# EAGLE design USB-to-UART (EAGLE 8.2.2)
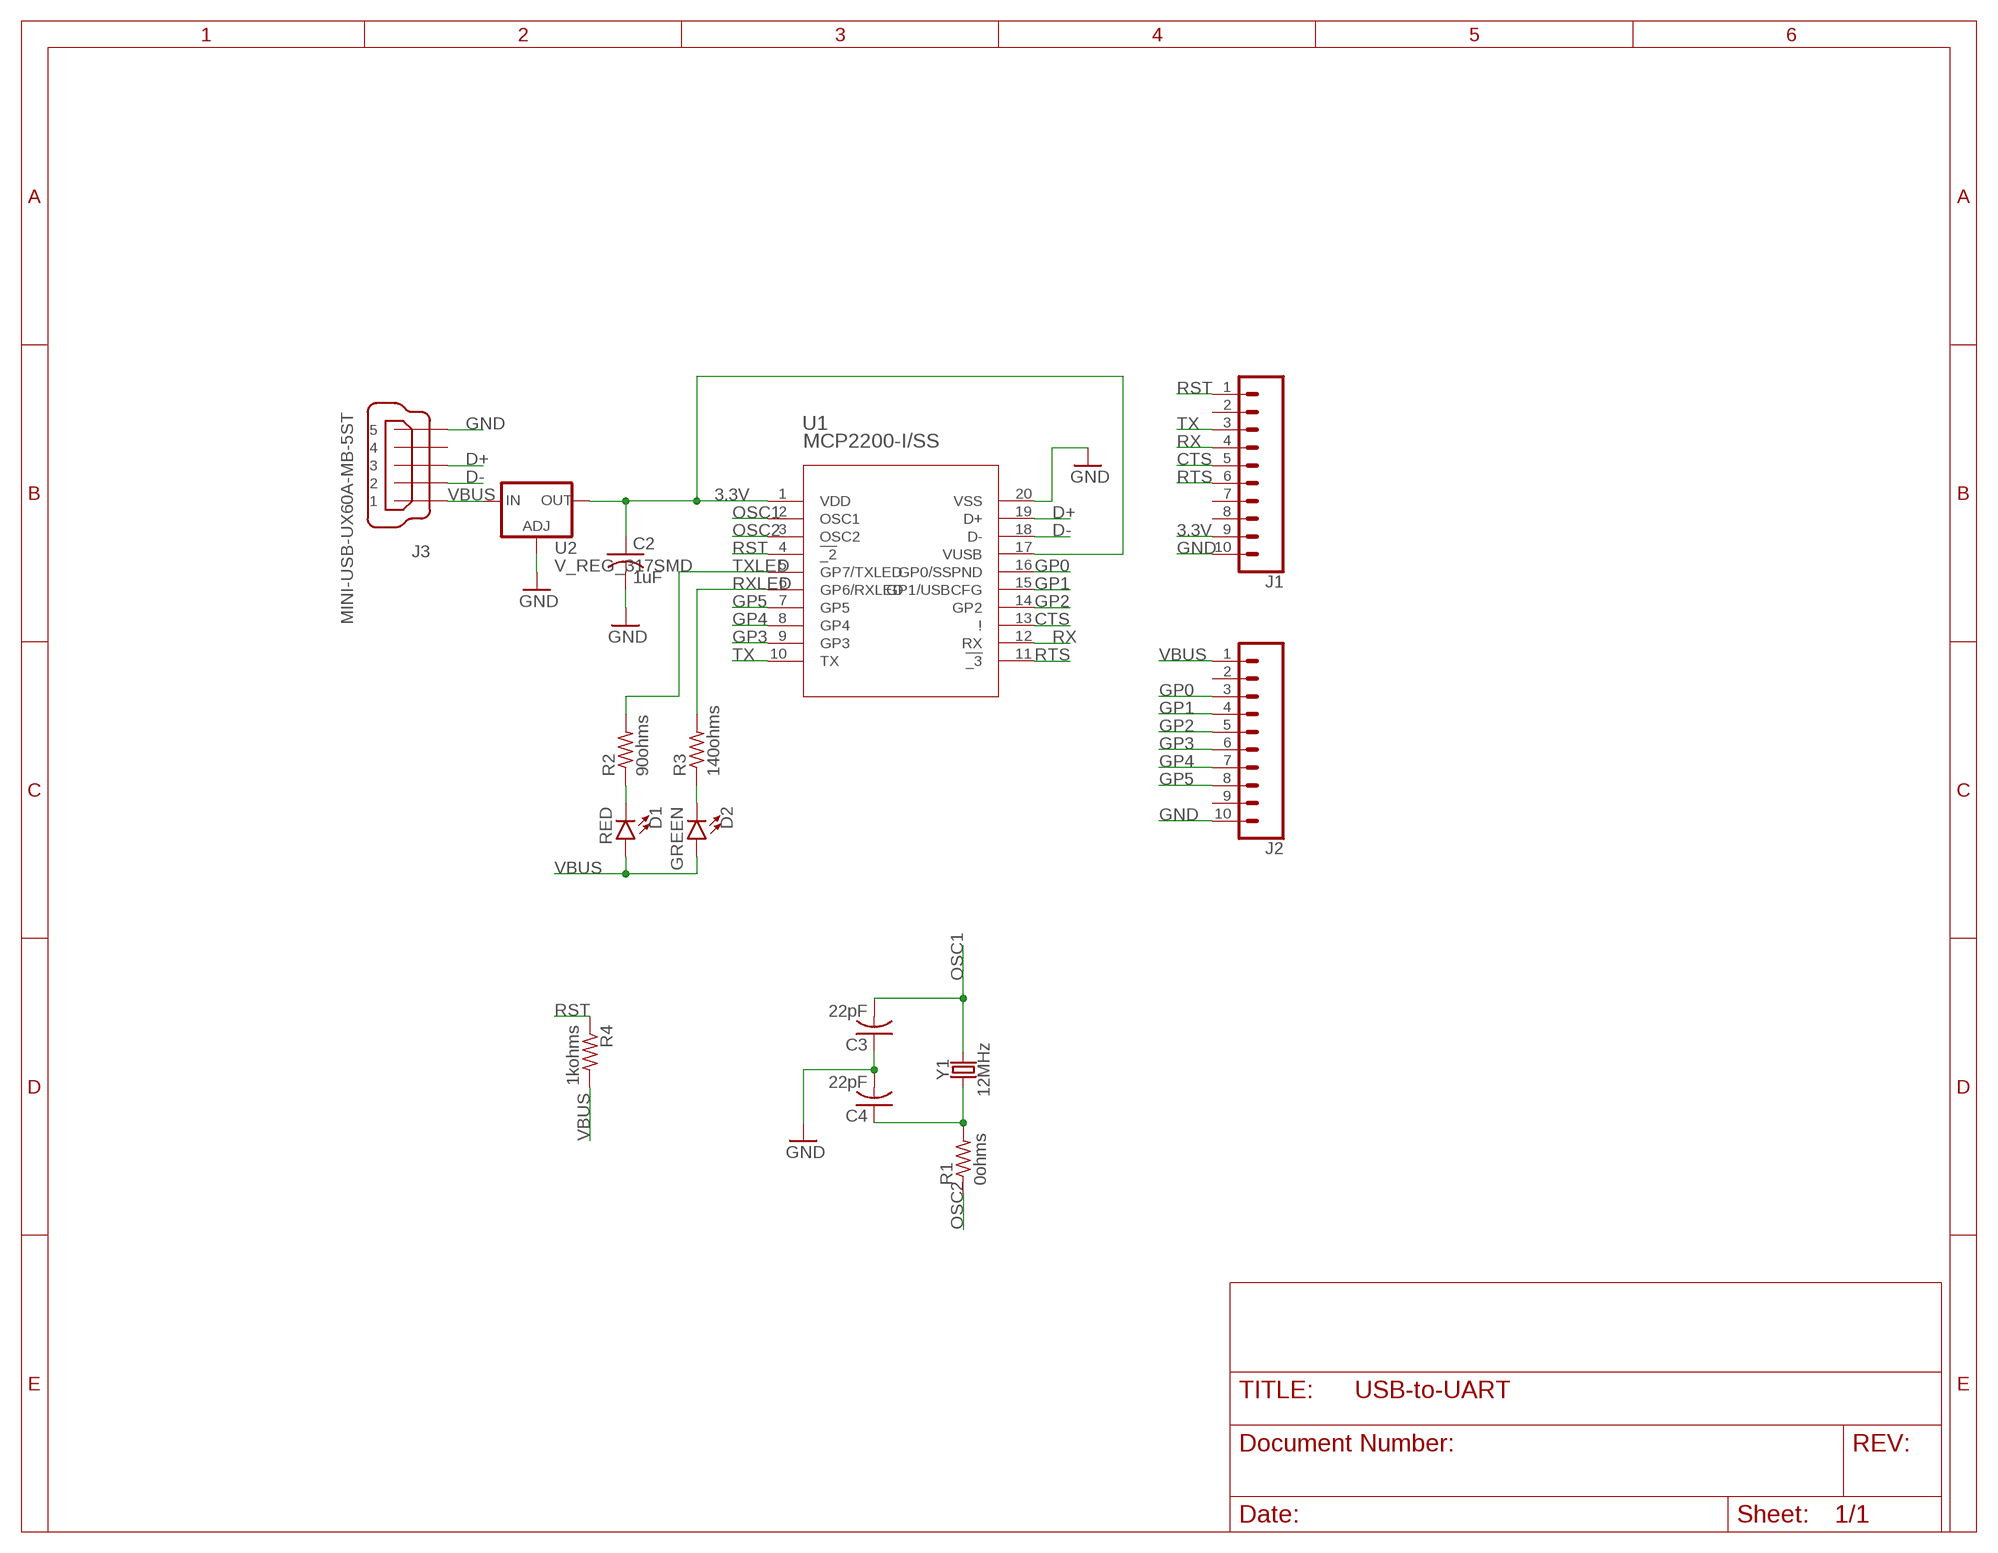
[diagram p0: schematic, sheet 1]

## Parts
C2  1uF  C-USC0603  [C0603]
C3  22pF  C-USC0603  [C0603]
C4  22pF  C-USC0603  [C0603]
D1  RED  LED0603  [LED-0603]
D2  GREEN  LED0603  [LED-0603]
J1  CONN_10"  [1X10]
J2  CONN_10"  [1X10]
J3  MINI-USB-UX60A-MB-5ST  [UX60A-MB-5ST]
R1  0ohms  R-US_R0603  [R0603]
R2  90ohms  R-US_R0603  [R0603]
R3  140ohms  R-US_R0603  [R0603]
R4  1kohms  R-US_R0603  [R0603]
U1  MCP2200-I/SS  [SSOP20_MC]
U2  V_REG_317SMD  [SOT223]
Y1  12MHz  CRYSTAL-12MHZ"  [CRYSTAL-SMD-5X3.2-4PAD]

## Nets
3.3V: C2.1 J1.9 U1.1(VDD) U1.17(VUSB) U2.2(OUT)
CTS: J1.5 U1.13(!)
D+: J3.3 U1.19(D+)
D-: J3.2 U1.18(D-)
GND: C2.2 C3.1 C4.2 J1.10 J2.10 J3.5 U1.20(VSS) U2.1(ADJ)
GP0: J2.3 U1.16(GP0/SSPND)
GP1: J2.4 U1.15(GP1/USBCFG)
GP2: J2.5 U1.14(GP2)
GP3: J2.6 U1.9(GP3)
GP4: J2.7 U1.8(GP4)
GP5: J2.8 U1.7(GP5)
N$1: D1.C R2.1
N$2: C4.1 R1.2 Y1.1
N$3: D2.C R3.1
OSC1: C3.2 U1.2(OSC1) Y1.3
OSC2: R1.1 U1.3(OSC2)
RST: J1.1 R4.1 U1.4(!_2)
RTS: J1.6 U1.11(!_3)
RX: J1.4 U1.12(RX)
RXLED: R3.2 U1.6(GP6/RXLED)
TX: J1.3 U1.10(TX)
TXLED: R2.2 U1.5(GP7/TXLED)
VBUS: D1.A D2.A J2.1 J3.1 R4.2 U2.3(IN)
Unconnected: J1.2 J1.7 J1.8 J2.2 J2.9 J3.4

## Library data of the parts
C2-C4 = rcl:C-US: CAPACITOR, American symbol
D1 D2 = SparkFun-LED:LED: LED (Generic) Standard schematic elements and footprints for 5mm, 3mm, 1206, and 0603 sized LEDs. Generic LEDs with no color specified.
J1 J2 = SparkFun-Connectors:CONN_10: Multi connection point. Often used as Generic Header-pin footprint for 0.1 inch spaced/style header connections On any of the 0.1 inch spaced packages, you can populate with these: Break Away Headers - Straight <https://www.sparkfun.com/products/116> (PRT-00116) Break Away Male Headers - Right Angle <https://www.sparkfun.com/products/553> (PRT-00553) Female Headers <https://www.sparkfun.com/products/115> (PRT-00115) Break Away Headers - Machine Pin <https://www.sparkfun.com/products/117> (PRT-00117) Break Away Female Headers - Swiss Machine Pin <https://www.sparkfun.com/products/743> (PRT-00743) Arduino Stackable Header - 10 Pin <https://www.sparkfun.com/products/11376> (PRT-11376) For SCREWTERMINALS and SPRING TERMINALS visit here: Screw Terimnals on SparkFun.com <https://www.sparkfun.com/search/results?term=Screw+Terminals> (5mm/3.5mm/2.54mm spacing) This device is also useful as a general connection point to wire up your design to another part of your project. Our various solder wires solder well into these plated through hole pads. Hook-Up Wire - Assortment (Stranded, 22 AWG) <https://www.sparkfun.com/products/11375> (PRT-11375) Hook-Up Wire - Assortment (Solid Core, 22 AWG) <https://www.sparkfun.com/products/11367> (PRT-11367) View the entire wire category on our website here <https://www.sparkfun.com/categories/141> Special notes: Molex polarized connector foot print use with SKU : PRT-08231 with associated crimp pins and housings. 1MM SMD Version SKU: PRT-10208 NOTES ON THE VARIANTS LOCK and LOCK_LONGPADS... This footprint was designed to help hold the alignment of a through-hole component (i.e. 6-pin header) while soldering it into place. You may notice that each hole has been shifted either up or down by 0.005 of an inch from it's more standard position (which is a perfectly straight line). This slight alteration caused the pins (the squares in the middle) to touch the edges of the holes. Because they are alternating, it causes a "brace" to hold the component in place. 0.005 has proven to be the perfect amount of "off-center" position when using our standard breakaway headers. Although looks a little odd when you look at the bare footprint, once you have a header in there, the alteration is very hard to notice. Also,if you push a header all the way into place, it is covered up entirely on the bottom side.; PROD_ID: CONN-11563
J3 = con-hirose:MINI-USB-: MINI USB Connector Source: http://www.hirose.co.jp/cataloge_hp/e24000019.pdf; OC_FARNELL: unknown; OC_NEWARK: unknown
R1-R4 = resistor:R-US_: RESISTOR, American symbol
U1 = MyLibrary - Components:MCP2200-I/SS; MANUFACTURER_PART_NUMBER: MCP2200ISS; VENDOR: Microchip
U2 = SparkFun-IC-Power:V_REG_317: Voltage Regulator Standard LM317 adjustable voltage regulator. AOI (Adjust Output Input). Google 'LM317 Calculator' for easy to use app to get the two resistor values needed. 240/720 for 5V output. 240/390 for 3.3V output. Spark Fun Electronics SKU : COM-00527
Y1 = SparkFun-Clocks:CRYSTAL-12MHZ: 12.0MHz Crystal Frequency: 12.0MHz Frequency Tolerance: ±20ppm Load Capacitance: 18pF SparkFun Products: SparkFun Logomatic <https://www.sparkfun.com/products/12772> Pocket AVR Programmer <https://www.sparkfun.com/products/9825>; PROD_ID: XTAL-08297

## Board
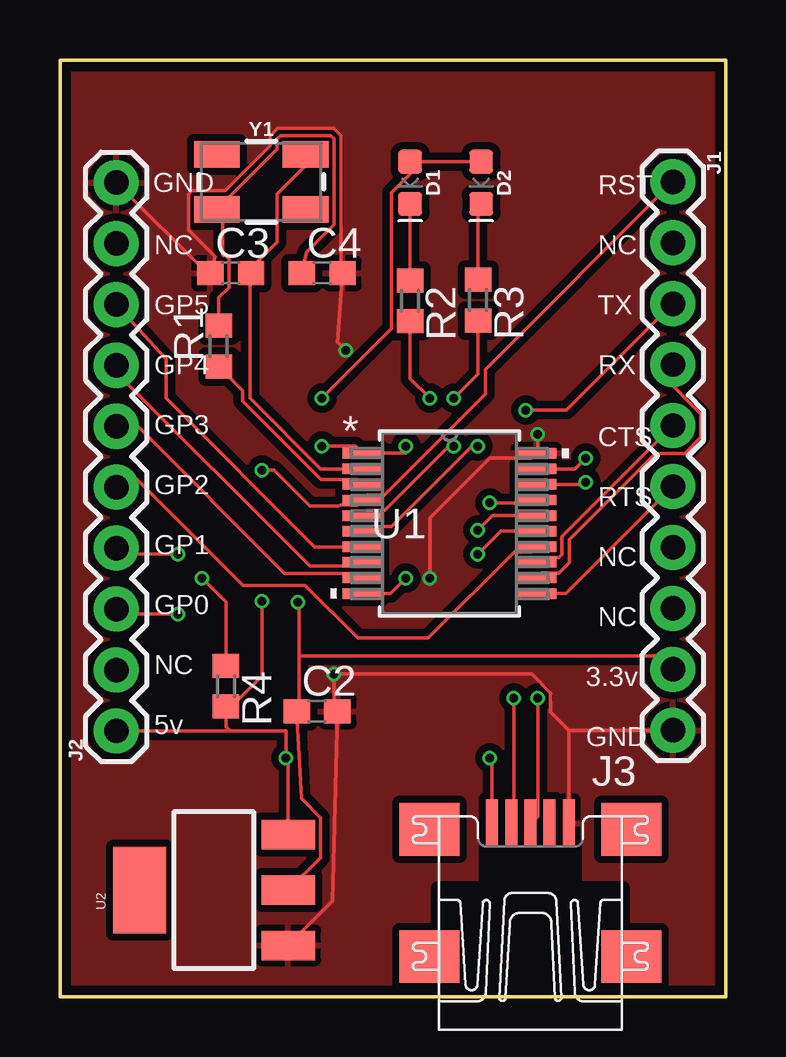
[diagram p1: board, top side]
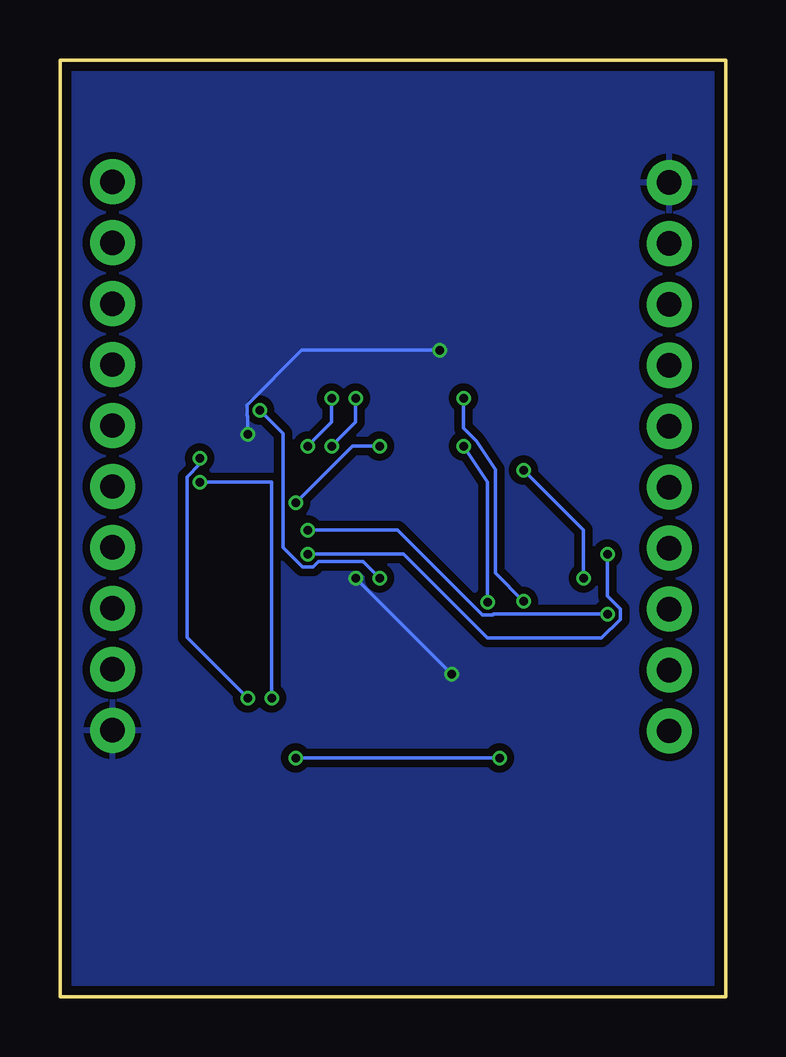
[diagram p2: board, bottom side, seen from below]

Size 27.75 x 39.06 mm. Coordinates in mm from the lower left corner, seen from the top.
Outline: 0,0 0,39.06 27.75,39.06 27.75,0 0,0
Copper layers (1*16): Top 0.035559375mm / dielectric 1.6mm / Bottom 0.035559375mm
Design rules "oshpark-2layer": minimum track width 6mil, minimum drill 10mil, track to track 6mil, track to pad 6mil, pad to pad 6mil, via to via 6mil, smd to smd 6mil, copper to edge 15mil, drill to drill 6mil, minimum pad ring 5mil, minimum via ring 5mil, stop-mask expansion 2.5mil, vias tented up to drill 0mil, thermal gap 10mil

### Footprints (pad centres in the part's own frame; a part is rotated, then mirrored left to right if it is on the bottom)
C0603 = smd 1.1 x 1: 1 -0.85,0; 2 0.85,0
LED-0603 = smd 1 x 1: A -0.877,0; C 0.877,0
1X10 = drill 1.016 pad 1.88: 1 0,0; 2 2.54,0; 3 5.08,0; 4 7.62,0; 5 10.16,0; 6 12.7,0; 7 15.24,0; 8 17.78,0; 9 20.32,0; 10 22.86,0
UX60A-MB-5ST = smd 2 x 0.5: 1 2.25,1.6; 2 2.25,0.8; 3 2.25,0; 4 2.25,-0.8; 5 2.25,-1.6 | smd 2.2 x 2.5: M1 -3.3,-4.2; M2 -3.3,4.2; M3 2,4.2; M4 2,-4.2
R0603 = smd 1 x 1.1: 1 -0.85,0; 2 0.85,0
SSOP20_MC = smd 1.651 x 0.432: 1 -3.632,2.925; 2 -3.632,2.275; 3 -3.632,1.625; 4 -3.632,0.975; 5 -3.632,0.325; 6 -3.632,-0.325; 7 -3.632,-0.975; 8 -3.632,-1.625; 9 -3.632,-2.275; 10 -3.632,-2.925; 11 3.632,-2.925; 12 3.632,-2.275; 13 3.632,-1.625; 14 3.632,-0.975; 15 3.632,-0.325; 16 3.632,0.325; 17 3.632,0.975; 18 3.632,1.625; 19 3.632,2.275; 20 3.632,2.925
SOT223 = smd 1.219 x 2.235: 1 -2.311,-3.099; 2 0,-3.099; 3 2.311,-3.099 | smd 3.6 x 2.2: 4 0,3.099
CRYSTAL-SMD-5X3.2-4PAD = smd 1.9 x 1.1: 1 -1.85,-1.15; 2 1.85,-1.15; 3 1.85,1.15; 4 -1.85,1.15

### Placement (x,y rotation side)
C2  10.72,11.91 0 top
C3  7.12,30.17 0 top
C4  10.93,30.17 0 top
D1  14.6,33.94 270 top
D2  17.56,33.94 270 top
J1  25.56,33.98 270 top
J2  2.35,11.09 90 top
J3  19.61,4.98 90 top
R1  6.62,27.13 90 top
R2  14.6,29.02 270 top
R3  17.43,29.05 270 top
R4  6.92,12.96 270 top
U1  16.24,19.74 0 top
U2  6.42,4.46 90 top
Y1  8.39,33.98 0 top

### Tracks (layer width: path | path; a pad name or v marks a point on that pad's centre or on a via)
3.3V  (via drill 0.35)
  Top 0.152: 9.97,14.21 9.97,16.41 v9.92,16.46 | U1.1 12.42,22.85 | v10.92,22.96 12.31,22.96 U1.1 | J1.9 25.56,14.21 9.97,14.21 | U1.17 19.87,20.6 v17.92,20.6 | v14.42,22.96 14.42,22.66 U1.1 | U2.2 10.87,5.81 10.87,7.48 10.07,8.27 C2.1 9.97,12.01 9.97,14.21
  Bottom 0.152: v9.92,16.46 9.92,21.46 v10.92,22.96 | v17.92,20.6 15.56,22.96 v14.42,22.96
CTS
  Top 0.152: J1.5 20.93,19.19 20.93,19.1 20.91,19.09 20.93,19.08 20.93,18.45 20.79,18.32 20.08,18.32 U1.13
D+  (via drill 0.35)
  Top 0.152: U1.19 21.48,22.02 v21.92,22.46 | v19.92,12.46 19.92,7.54 J3.3
  Bottom 0.152: 21.92,22.3 v21.92,22.46 | 21.92,22.3 21.92,22.21 | 21.92,22.21 21.92,22.3 | 21.92,22.21 22.45,21.68 22.45,14.99 v19.92,12.46
D-  (via drill 0.35)
  Top 0.152: U1.18 21.83,21.37 v21.92,21.46 | v18.92,12.46 18.92,7.34 J3.2
  Bottom 0.152: v21.92,21.46 18.92,21.46 v18.92,12.46
GND  (via drill 0.35)
  Top 0.152: v15.42,17.46 15.42,19.96 17.92,22.46 19.67,22.46 U1.20 19.92,22.71 v19.92,23.46 | 21.21,11.12 J3.5 | J1.10 21.21,11.12 | 9.52,2.41 U2.1 11.37,4 C2.2 11.42,11.96 v11.42,13.46 19.67,13.46 20.45,12.68 20.45,11.88 21.21,11.12 | J2.10 6.13,30.17 C3.1 6.47,30.86 5.36,31.97 5.36,33.48 5.49,33.61 6.89,33.61 8.76,35.48 8.76,35.9 9.07,36.21 11.41,36.21 11.72,35.9 11.72,30.49 11.58,30.35 C4.2 11.58,27.3 v11.92,26.96
  Bottom 0.152: v15.42,17.46 v11.42,13.46 | v19.92,23.46 19.92,24.21 19.95,24.24 19.95,24.68 17.67,26.96 v11.92,26.96
  pour Bottom (isolate 0.305): -0.08,38.96 27.92,39.46 27.92,-0.04 -0.08,-0.04
  pour Top (isolate 0.305): -0.08,38.96 -0.08,-0.04 27.92,-0.04 27.92,38.96
GP0  (via drill 0.35)
  Top 0.152: U1.16 18.02,20.07 v17.42,19.46 | v4.92,15.96 2.36,15.96 J2.3
  Bottom 0.152: v17.42,19.46 13.67,19.46 10.14,15.93 9.7,15.93 9.67,15.96 v4.92,15.96
GP1  (via drill 0.35)
  Top 0.152: U1.15 18.38,19.41 v17.42,18.46 | v4.92,18.46 2.4,18.46 J2.4
  Bottom 0.152: v17.42,18.46 13.42,18.46 9.92,14.96 5.17,14.96 4.39,15.74 4.39,16.18 4.92,16.71 v4.92,18.46
GP2
  Top 0.152: J2.5 3.19,21.6 7.63,17.15 10.22,17.15 12.42,14.96 15.35,14.96 18.95,18.56 19.67,18.56 U1.14
GP3
  Top 0.152: U1.9 12.42,17.66 9.37,17.66 3.24,23.79 J2.6
GP4
  Top 0.152: J2.7 2.35,26.03 10.42,17.96 12.45,17.96 U1.8
GP5
  Top 0.152: U1.7 10.62,18.77 4.42,24.96 4.42,26.6 J2.8
N$1
  Top 0.152: R2.1 D1.C
N$2
  Top 0.152: C4.1 10.28,31.05 11.42,32.19 11.42,35.77 11.28,35.91 9.2,35.91 9.06,35.77 9.06,35.35 Y1.1 6.73,32.63 6.78,32.56 6.78,30.94 6.8,30.9 | 6.8,30.9 6.91,30.9 7.05,30.77 7.05,29.57 6.62,29.15 R1.2 | 6.8,30.9
N$3
  Top 0.152: R3.1 17.43,32.93 D2.C
OSC1
  Top 0.152: Y1.3 10.24,34.65 9.06,33.48 9.06,31.46 7.83,30.23 | 7.83,30.23 C3.2 | U1.2 10.87,22.02 7.92,24.96 7.92,30.14 7.83,30.23
OSC2
  Top 0.152: U1.3 12.4,21.57 10.88,21.57 7.62,24.83 7.62,25.29 R1.1
RST  (via drill 0.35)
  Top 0.152: R4.1 6.92,16.46 v5.92,17.46 | v8.42,21.96 8.92,21.96 10.42,20.46 11.64,20.46 11.69,20.51 12.4,20.51 U1.4 12.81,20.92 13.53,20.92 17.73,25.13 17.73,26.16 J1.1
  Bottom 0.152: v5.92,17.46 5.92,19.46 v8.42,21.96
RTS
  Top 0.152: U1.11 21.09,16.82 J1.6
RX
  Top 0.152: U1.12 20.08,17.67 20.79,17.67 21.23,18.11 21.23,19.06 24.82,22.65 26.04,22.65 26.73,23.34 26.73,24.3 25.12,25.92 J1.4
RXLED  (via drill 0.35)
  Top 0.152: R3.2 17.43,25.97 v16.42,24.96 | U1.6 12.81,19.62 13.83,19.62 17.17,22.96 v17.42,22.96
  Bottom 0.152: v16.42,24.96 16.42,23.96 v17.42,22.96
TX  (via drill 0.35)
  Top 0.152: U1.10 13.78,16.82 v14.42,17.46 | v19.42,24.46 21.12,24.46 J1.3
  Bottom 0.152: v14.42,17.46 15.12,18.16 16.97,18.16 17.2,17.93 17.64,17.93 18.45,18.74 18.45,23.49 v19.42,24.46
TXLED  (via drill 0.35)
  Top 0.152: R2.2 14.6,25.78 v15.42,24.96 | U1.5 12.81,20.27 13.53,20.27 16.22,22.96 v16.42,22.96
  Bottom 0.152: v15.42,24.96 15.42,23.96 v16.42,22.96
VBUS  (via drill 0.35)
  Top 0.152: J3.1 18.01,9.96 v17.92,9.96 | 9.42,10.05 9.42,11.09 7.1,11.09 | 9.42,10.05 v9.42,9.96 | 7.1,11.09 J2.1 | U2.3 9.52,10.05 9.42,10.05 | 6.92,11.88 R4.2 | 6.92,11.88 6.92,11.27 7.1,11.09 | D2.A D1.A 14.6,34.3 13.82,33.52 13.82,27.86 v10.92,24.96 | v8.42,16.49 8.42,13.38 6.92,11.88
  Bottom 0.152: v17.92,9.96 v9.42,9.96 | v8.42,16.49 9.6,17.67 9.6,21.99 10.39,23.18 10.92,23.71 v10.92,24.96

### Text on the board
tPlace: GND | RST | NC | NC | GP5 | TX | GP4 | RX | GP3 | CTS | GP2 | RTS | GP1 | NC | GP0 | NC | NC | 3.3v | 5v | GND